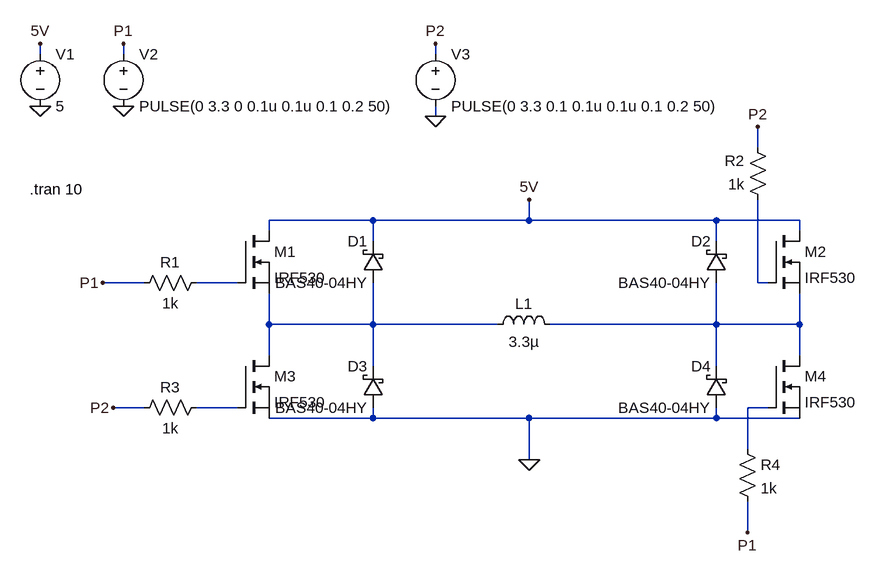
[diagram p0: schematic H-Bridge_sim.asc]
H-Bridge_sim.asc, the LTspice schematic file:
Version 4
SHEET 1 1528 880
WIRE 224 80 224 64
WIRE 352 80 352 64
WIRE 832 80 832 64
WIRE 832 176 832 160
WIRE 1328 224 1328 192
WIRE 736 336 576 336
WIRE 976 336 976 304
WIRE 976 336 736 336
WIRE 1264 336 976 336
WIRE 1392 336 1264 336
WIRE 576 352 576 336
WIRE 1392 352 1392 336
WIRE 736 368 736 336
WIRE 1264 368 1264 336
WIRE 384 432 320 432
WIRE 528 432 464 432
WIRE 1328 432 1328 304
WIRE 1344 432 1328 432
WIRE 576 496 576 448
WIRE 736 496 736 432
WIRE 736 496 576 496
WIRE 928 496 736 496
WIRE 1264 496 1264 432
WIRE 1264 496 1008 496
WIRE 1392 496 1392 448
WIRE 1392 496 1264 496
WIRE 576 544 576 496
WIRE 1392 544 1392 496
WIRE 736 560 736 496
WIRE 1264 560 1264 496
WIRE 384 624 336 624
WIRE 528 624 464 624
WIRE 1344 624 1312 624
WIRE 736 640 736 624
WIRE 736 640 576 640
WIRE 976 640 736 640
WIRE 1264 640 1264 624
WIRE 1264 640 976 640
WIRE 1392 640 1264 640
WIRE 1312 688 1312 624
WIRE 976 704 976 640
WIRE 1312 816 1312 768
FLAG 224 160 0
FLAG 224 64 5V
FLAG 352 160 0
FLAG 352 64 P1
FLAG 976 704 0
FLAG 976 304 5V
FLAG 320 432 P1
FLAG 1312 816 P1
FLAG 832 64 P2
FLAG 832 176 0
FLAG 336 624 P2
FLAG 1328 192 P2
SYMBOL Voltage 224 64 R0
SYMATTR InstName V1
SYMATTR Value 5
SYMBOL Voltage 352 64 R0
SYMATTR InstName V2
SYMATTR Value PULSE(0 3.3 0 0.1u 0.1u 0.1 0.2 50)
SYMBOL schottky 752 432 R180
WINDOW 0 24 64 Left 2
WINDOW 3 24 0 Left 2
SYMATTR InstName D1
SYMATTR Value BAS40-04HY
SYMBOL nmos 528 352 R0
SYMATTR InstName M1
SYMATTR Value IRF530
SYMBOL nmos 1344 352 R0
SYMATTR InstName M2
SYMATTR Value IRF530
SYMBOL nmos 528 544 R0
SYMATTR InstName M3
SYMATTR Value IRF530
SYMBOL nmos 1344 544 R0
SYMATTR InstName M4
SYMATTR Value IRF530
SYMBOL Res 480 416 R90
WINDOW 0 0 56 VBottom 2
WINDOW 3 32 56 VTop 2
SYMATTR InstName R1
SYMATTR Value 1k
SYMBOL Res 1344 320 R180
WINDOW 0 36 76 Left 2
WINDOW 3 36 40 Left 2
SYMATTR InstName R2
SYMATTR Value 1k
SYMBOL Res 368 640 R270
WINDOW 0 32 56 VTop 2
WINDOW 3 0 56 VBottom 2
SYMATTR InstName R3
SYMATTR Value 1k
SYMBOL Res 1296 672 R0
SYMATTR InstName R4
SYMATTR Value 1k
SYMBOL schottky 1280 432 R180
WINDOW 0 24 64 Left 2
WINDOW 3 24 0 Left 2
SYMATTR InstName D2
SYMATTR Value BAS40-04HY
SYMBOL schottky 752 624 R180
WINDOW 0 24 64 Left 2
WINDOW 3 24 0 Left 2
SYMATTR InstName D3
SYMATTR Value BAS40-04HY
SYMBOL schottky 1280 624 R180
WINDOW 0 24 64 Left 2
WINDOW 3 24 0 Left 2
SYMATTR InstName D4
SYMATTR Value BAS40-04HY
SYMBOL Voltage 832 64 R0
SYMATTR InstName V3
SYMATTR Value PULSE(0 3.3 0.1 0.1u 0.1u 0.1 0.2 50)
SYMBOL Ind 912 512 R270
WINDOW 0 32 56 VTop 2
WINDOW 3 5 56 VBottom 2
SYMATTR InstName L1
SYMATTR Value 3.3µ
TEXT 208 288 Left 2 !.tran 10

The netlist it stands for:
* H-Bridge_sim.asc
V1 5V 0 5
V2 P1 0 PULSE(0 3.3 0 0.1u 0.1u 0.1 0.2 50)
D1 N003 5V BAS40-04HY
M1 5V N001 N003 N003 IRF530
M2 5V N002 N004 N004 IRF530
M3 N003 N005 0 0 IRF530
M4 N004 N006 0 0 IRF530
R1 N001 P1 1k
R2 N002 P2 1k
R3 P2 N005 1k
R4 N006 P1 1k
D2 N004 5V BAS40-04HY
D3 0 N003 BAS40-04HY
D4 0 N004 BAS40-04HY
V3 P2 0 PULSE(0 3.3 0.1 0.1u 0.1u 0.1 0.2 50)
L1 N003 N004 3.3µ
.model D D
.lib standard.dio
.model NMOS NMOS
.model PMOS PMOS
.lib standard.mos
.tran 10
.backanno
.end